# Altium schematic sheet Air conditioning.SchDoc
size A4
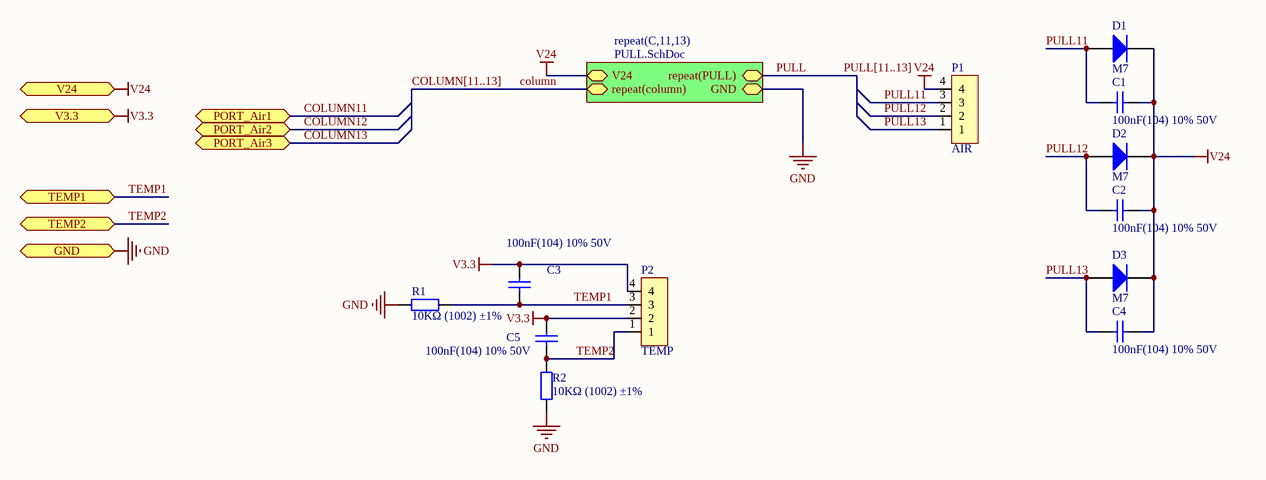
[diagram p0: Air conditioning.SchDoc]

## Parts
C1  100nF(104) 10% 50V  [0805_C]
C2  100nF(104) 10% 50V  [0805_C]
C3  100nF(104) 10% 50V  [0805_C]
C4  100nF(104) 10% 50V  [0805_C]
C5  100nF(104) 10% 50V  [0805_C]
D1  M7  [SMA(DO-214AC)_S1]
D2  M7  [SMA(DO-214AC)_S1]
D3  M7  [SMA(DO-214AC)_S1]
P1  AIR  [4P_XH2.54]
P2  TEMP  [4P_XH2.54]
R1  10KΩ (1002) ±1%  [0805_R]
R2  10KΩ (1002) ±1%  [0805_R]

## Sub-sheets
repeat(C,11,13) = PULL.SchDoc: GND, repeat(PULL), V24, repeat(column)

## Ports
GND, PORT_Air1, PORT_Air2, PORT_Air3, TEMP1, TEMP2, V3.3, V24

## Nets
GND: R1.2 R2.2 ; port GND, sheet repeat(C,11,13)/GND
V3.3: C3.1 C5.1 P2.2 P2.4 ; port V3.3
V24: C1.2 C2.2 C4.2 D1.2(K) D2.2(K) D3.2(K) P1.4 ; port V24, sheet repeat(C,11,13)/V24
column: sheet repeat(C,11,13)/repeat(column)
COLUMN11: port PORT_Air1
COLUMN12: port PORT_Air2
COLUMN13: port PORT_Air3
PULL: sheet repeat(C,11,13)/repeat(PULL)
PULL11: C1.1 D1.1(A) P1.3
PULL12: C2.1 D2.1(A) P1.2
PULL13: C4.1 D3.1(A) P1.1
TEMP1: C3.2 P2.3 R1.1 ; port TEMP1
TEMP2: C5.2 P2.1 R2.1 ; port TEMP2

## Buses and harness runs
bus COLUMN[11..13]
bus PULL[11..13]

## Library data of the parts
C1-C5 = 0805 100nF(104) 10% 50V: 贴片电容; ComponentLink1Description: 供应商链接; ComponentLink1URL: http://www.szlcsc.com/product/details_50686.html; Package: 0805; Supplier: LC; SuppliersPartNumber: C49678
D1-D3 = SMA(DO-214AC) M7: 二极管; 备注: 1N4007 4007 编号C2464 已经停售, 使用新物料编号C95872; ComponentLink1Description: 供应商链接; ComponentLink1URL: http://www.szlcsc.com/product/details_2841.html; Package: SMA(DO-214AC); Supplier: LC; SuppliersPartNumber: C95872
P1 P2 = 4P_XH2.54
R1 R2 = 0805 10KΩ (1002) 1%: 贴片电阻; ComponentLink1Description: 供应商链接; ComponentLink1URL: http://www.szlcsc.com/product/details_18102.html; Package: 0805; Supplier: LC; SuppliersPartNumber: C17414